# EAGLE board mcat-4cu-b-v2c (EAGLE 6.5.0)
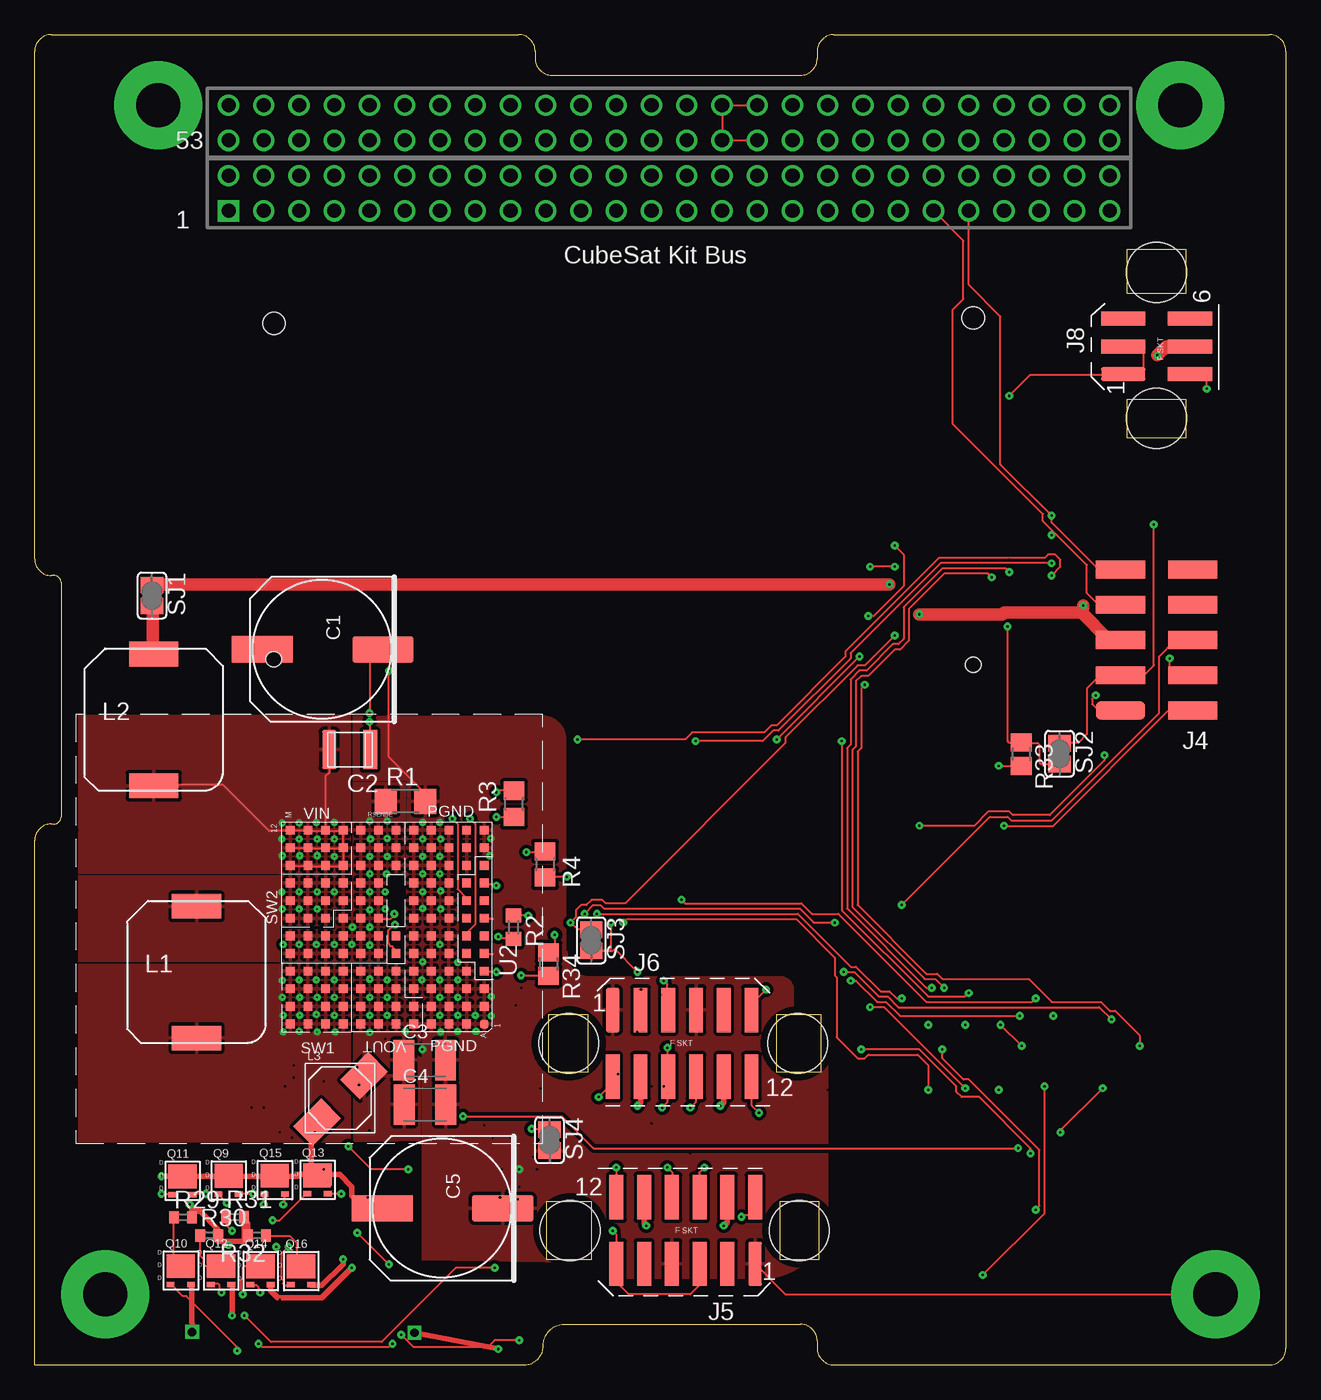
[diagram p5: board, top side]
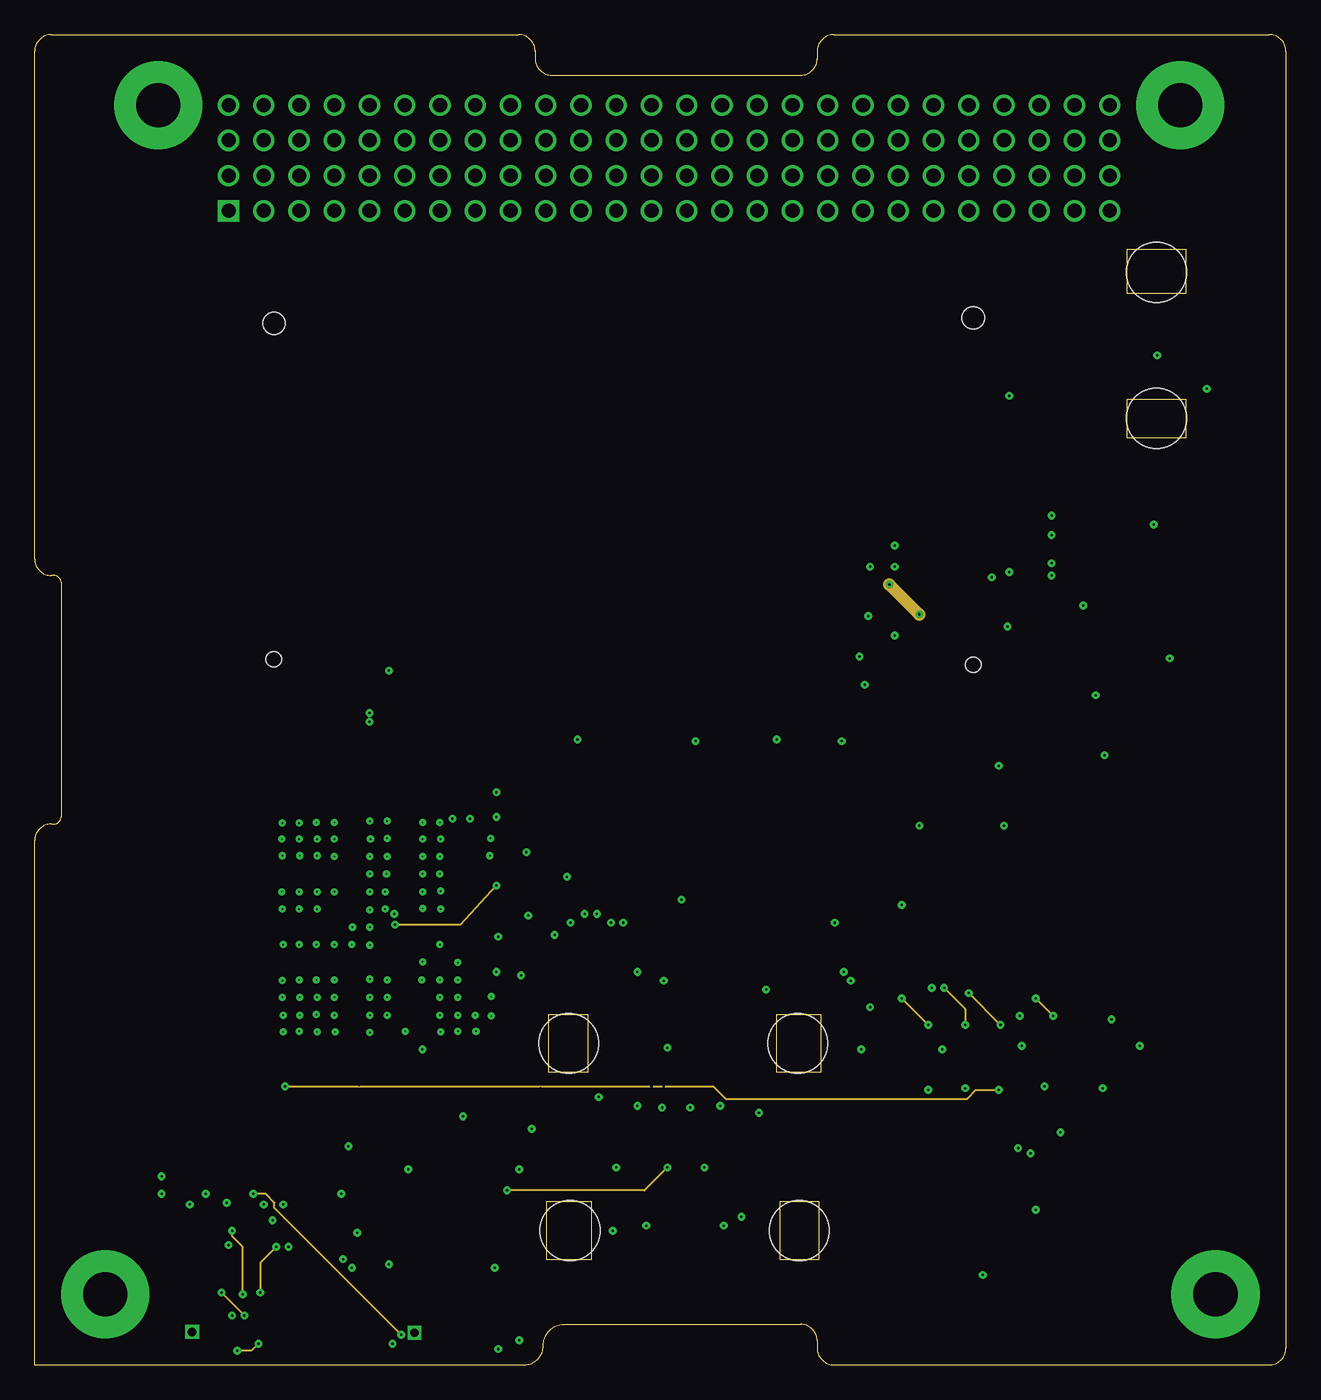
[diagram p6: board, inner layer Route2]
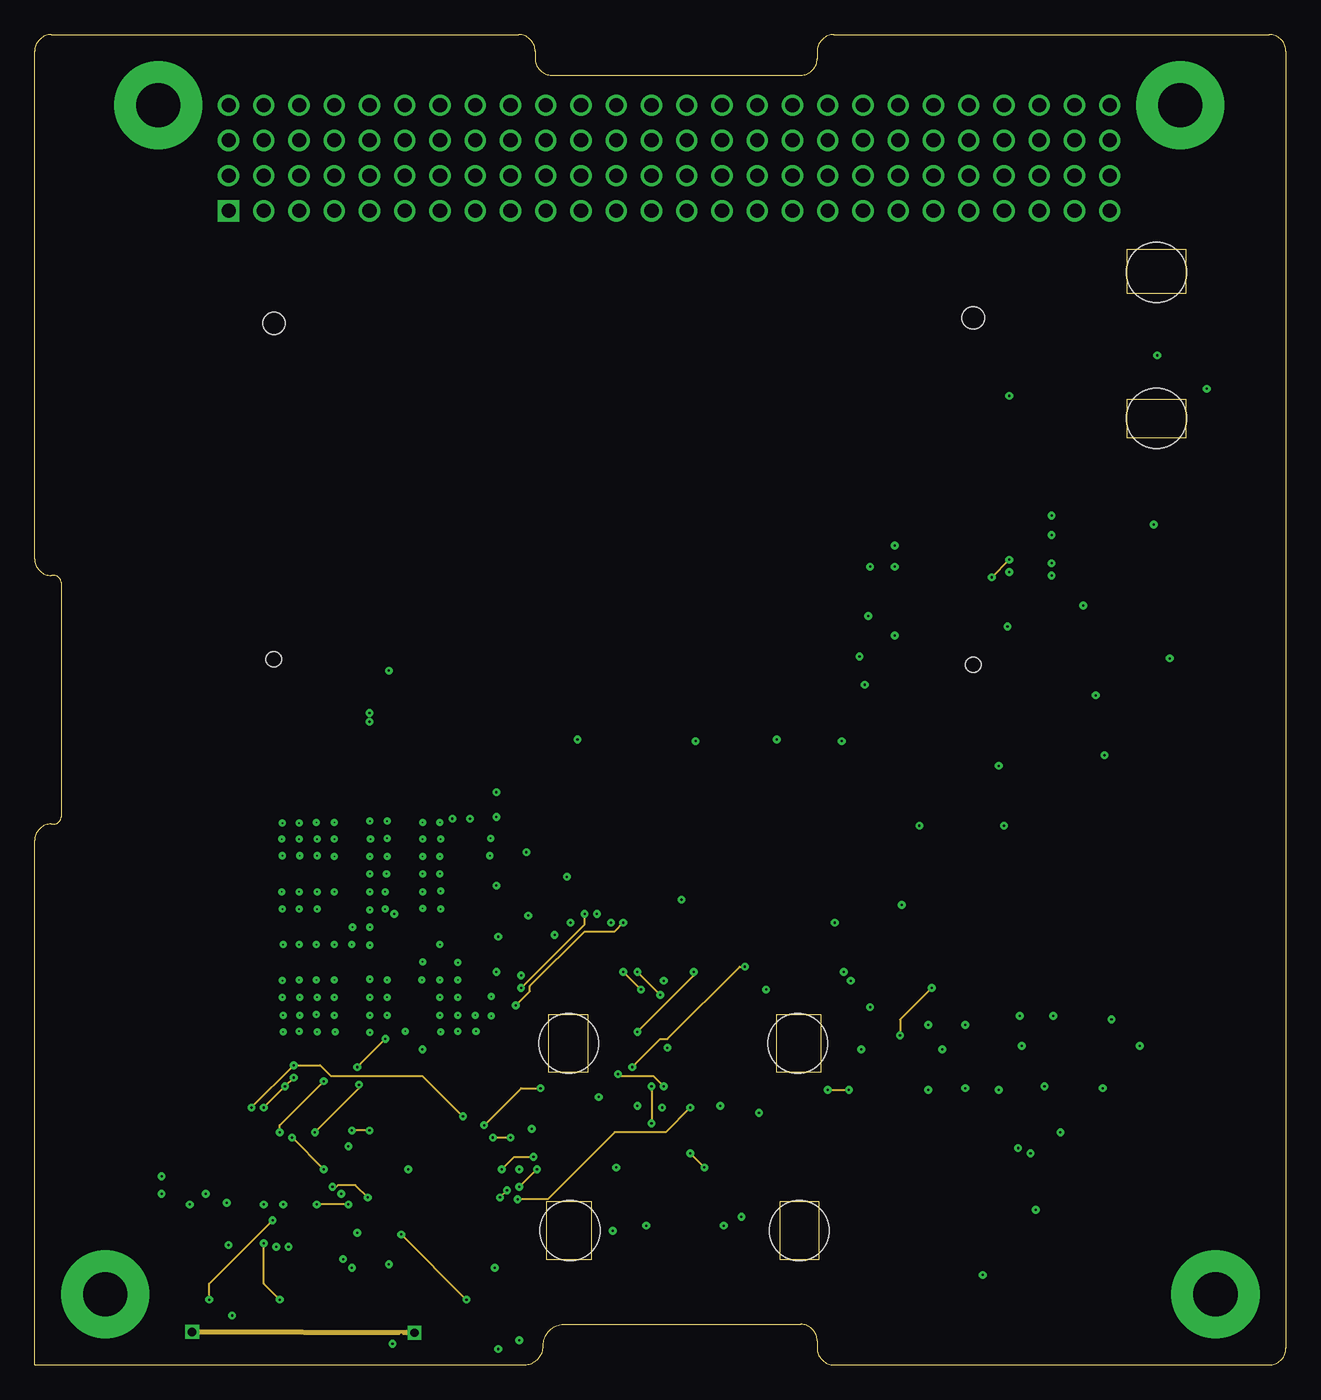
[diagram p7: board, inner layer Route15]
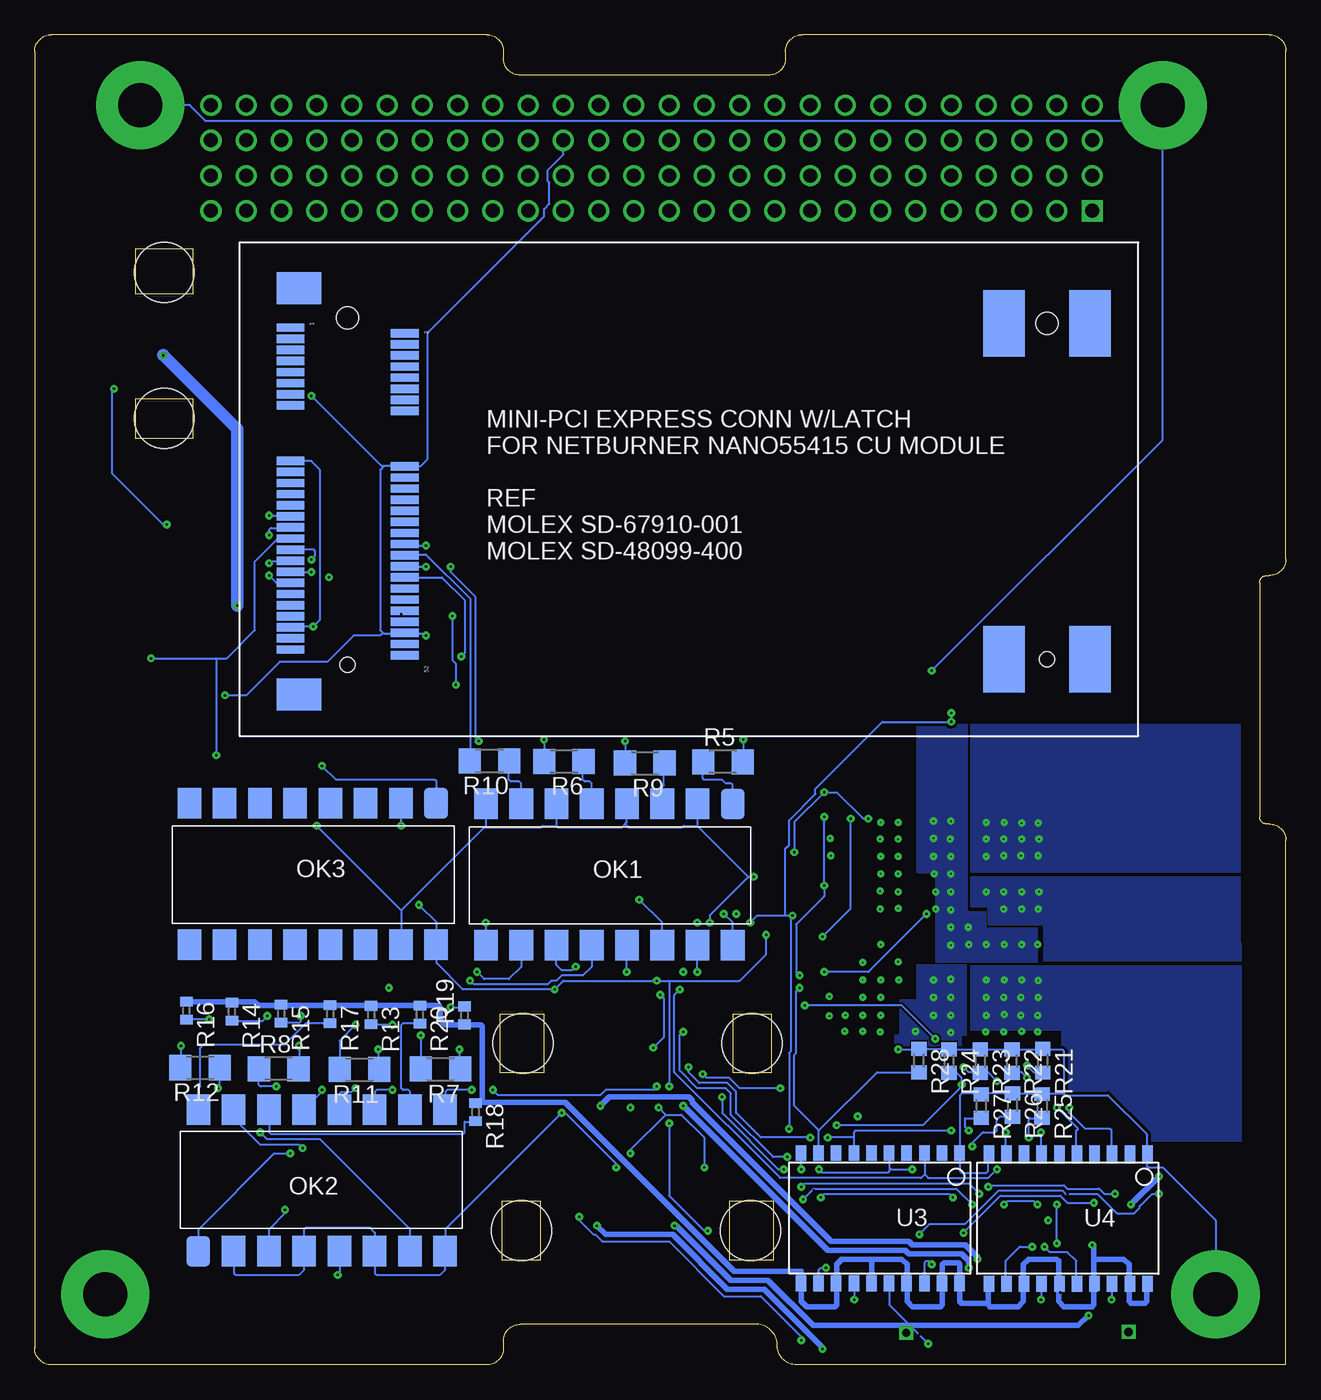
[diagram p8: board, bottom side, seen from below]

Size 90.17 x 95.89 mm. Coordinates in mm from the lower left corner, seen from the top.
Outline: 0,0 34.87,0 35.28,0 arc90 36.65,1.37 arc-90 38.12,2.92 55.19,2.92 arc-90 56.39,1.73 56.39,1.19 arc90 57.58,0 88.98,0 arc90 90.17,1.19 90.17,94.69 arc90 88.98,95.89 57.58,95.89 arc90 56.39,94.69 56.39,94.16 arc-90 55.19,92.96 37.26,92.96 arc-90 36.07,94.16 36.07,94.69 arc90 34.87,95.89 1.19,95.89 arc90 0,94.69 0,58.09 arc90 1.19,56.9 1.4,56.9 arc-90 1.91,56.39 1.91,39.5 arc-90 1.4,38.99 1.19,38.99 arc90 0,37.8 0,0
Copper layers [2:(1+(2*15)+16):15]: Top 0.0694mm / dielectric 8mil / Route2 0.0347mm / dielectric 3.5mil / Route15 0.0347mm / dielectric 8mil / Bottom 0.0694mm
Design rules "SSC-EAGLE-6Lyr_v1.0.0.3 *": minimum track width 6mil, minimum drill 6mil, track to track 6mil, track to pad 6mil, pad to pad 6mil, via to via 6mil, smd to smd 6mil, copper to edge 20mil, drill to drill 16mil, minimum pad ring 8mil, minimum via ring 8mil, stop-mask expansion 3mil, vias tented up to drill 0mil, thermal gap 10mil
Net classes: 0 default: clearance 0.205 mm; 1 vout1a2ozcu: width 0.406 mm; 2 vin2a2ozcu: width 0.889 mm
tRestrict: 30 lines

## Footprints (pad centres in the part's own frame; a part is rotated, then mirrored left to right if it is on the bottom)
OS-CON-SVPF-F12 = smd 1.9 x 4.4: A1 0,-4.3; K1 0,4.4
MLCC-X7R-1210 = smd 1 x 2.8: 1 1.6,0.05; 2 -1.35,0.05
C1210K = smd 1.5 x 2.9: 1 -1.5,0; 2 1.5,0
CSK_MOUNTING_HOLE = drill 3.175 pad 6.35: P$1 0,0
CSK-BUS-PKG = drill 1.016 pad 1.524 square: 1 -29.21,-3.81 | drill 1.016 pad 1.524: 2 -29.21,-1.27; 3 -26.67,-3.81; 4 -26.67,-1.27; 5 -24.13,-3.81; 6 -24.13,-1.27; 7 -21.59,-3.81; 8 -21.59,-1.27; 9 -19.05,-3.81; 10 -19.05,-1.27; 11 -16.51,-3.81; 12 -16.51,-1.27; 13 -13.97,-3.81; 14 -13.97,-1.27; 15 -11.43,-3.81; 16 -11.43,-1.27; 17 -8.89,-3.81; 18 -8.89,-1.27; 19 -6.35,-3.81; 20 -6.35,-1.27; 21 -3.81,-3.81; 22 -3.81,-1.27; 23 -1.27,-3.81; 24 -1.27,-1.27; 25 1.27,-3.81; 26 1.27,-1.27; 27 3.81,-3.81; 28 3.81,-1.27; 29 6.35,-3.81; 30 6.35,-1.27; 31 8.89,-3.81; 32 8.89,-1.27; 33 11.43,-3.81; 34 11.43,-1.27; 35 13.97,-3.81; 36 13.97,-1.27; 37 16.51,-3.81; 38 16.51,-1.27; 39 19.05,-3.81; 40 19.05,-1.27; 41 21.59,-3.81; 42 21.59,-1.27; 43 24.13,-3.81; 44 24.13,-1.27; 45 26.67,-3.81; 46 26.67,-1.27; 47 29.21,-3.81; 48 29.21,-1.27; 49 31.75,-3.81; 50 31.75,-1.27; 51 34.29,-3.81; 52 34.29,-1.27; 53 -29.21,1.27; 54 -29.21,3.81; 55 -26.67,1.27; 56 -26.67,3.81; 57 -24.13,1.27; 58 -24.13,3.81; 59 -21.59,1.27; 60 -21.59,3.81; 61 -19.05,1.27; 62 -19.05,3.81; 63 -16.51,1.27; 64 -16.51,3.81; 65 -13.97,1.27; 66 -13.97,3.81; 67 -11.43,1.27; 68 -11.43,3.81; 69 -8.89,1.27; 70 -8.89,3.81; 71 -6.35,1.27; 72 -6.35,3.81; 73 -3.81,1.27; 74 -3.81,3.81; 75 -1.27,1.27; 76 -1.27,3.81; 77 1.27,1.27; 78 1.27,3.81; 79 3.81,1.27; 80 3.81,3.81; 81 6.35,1.27; 82 6.35,3.81; 83 8.89,1.27; 84 8.89,3.81; 85 11.43,1.27; 86 11.43,3.81; 87 13.97,1.27; 88 13.97,3.81; 89 16.51,1.27; 90 16.51,3.81; 91 19.05,1.27; 92 19.05,3.81; 93 21.59,1.27; 94 21.59,3.81; 95 24.13,1.27; 96 24.13,3.81; 97 26.67,1.27; 98 26.67,3.81; 99 29.21,1.27; 100 29.21,3.81; 101 31.75,1.27; 102 31.75,3.81; 103 34.29,1.27; 104 34.29,3.81
AMPMODU-SMT-PIN-HEADER-5X2 = smd 1.27 x 3.556: 1 -4.826,2.54; 2 -2.286,2.54; 3 0.254,2.54; 4 2.794,2.54; 5 5.334,2.54; 6 -4.826,-2.667; 7 -2.286,-2.667; 8 0.254,-2.667; 9 2.794,-2.667; 10 5.334,-2.667
M80-68112 = smd 1 x 3.2: 1 0,2.4; 2 2,2.4; 3 4,2.4; 4 6,2.4; 5 8,2.4; 6 10,2.4; 7 0,-2.4; 8 2,-2.4; 9 4,-2.4; 10 6,-2.4; 11 8,-2.4; 12 10,-2.4 | hole 4.318: -3.175,0; 13.335,0
M80-68106 = smd 1 x 3.2: 1 -2,2.4; 2 0,2.4; 3 2,2.4; 4 -2,-2.4; 5 0,-2.4; 6 2,-2.4 | hole 4.318: -5.175,0; 5.335,0
MSS1048 = smd 3.56 x 1.78: 1 5,9.85; 2 5,0.35
SERIES-POWER-INDUCTORS = smd 2.85 x 2 rotated 45: 1 1.75,1.6; 2 -1.65,-1.75
PS2501L-4 = smd 2.2 x 1.7: 1 -1.6,19.03; 2 -1.6,16.49; 3 -1.6,13.95; 4 -1.6,11.41; 5 -1.6,8.87; 6 -1.6,6.33; 7 -1.6,3.79; 8 -1.6,1.25; 9 8.6,1.25; 10 8.6,3.79; 11 8.6,6.33; 12 8.6,8.87; 13 8.6,11.41; 14 8.6,13.95; 15 8.6,16.49; 16 8.6,19.03
1206-8-CHIPFET = smd 2.032 x 1.727: D 0,1.321 | smd 0.559 x 0.406: G -0.736,0; S 0.736,0
R1206 = smd 1.6 x 1.803: 1 -1.422,0; 2 1.422,0
R0603 = smd 1 x 1.1: 1 -0.85,0; 2 0.85,0
R0805 = smd 1.3 x 1.5: 1 -0.95,0; 2 0.95,0
R0402 = smd 0.7 x 0.9: 1 -0.65,0; 2 0.65,0
R0805' = smd 1.3 x 1.5: 1 -0.85,0; 2 0.85,0
SJ = smd 1.168 x 1.6: 1 -0.762,0; 2 0.762,0
MOLEX-MINI-PCI-EXPRESS-8MM-52CKT = smd 0.6 x 2: 1 -11.65,-26.8; 2 -11.248,-18.576; 3 -10.85,-26.8; 4 -10.447,-18.576; 5 -10.05,-26.8; 6 -9.648,-18.576; 7 -9.25,-26.8; 8 -8.848,-18.576; 9 -8.45,-26.8; 10 -8.047,-18.576; 11 -7.65,-26.8; 12 -7.247,-18.576; 13 -6.85,-26.8; 14 -6.447,-18.576; 15 -6.05,-26.8; 16 -5.647,-18.576; 17 -2.05,-26.8; 18 -1.647,-18.576; 19 -1.25,-26.8; 20 -0.848,-18.576; 21 -0.45,-26.8; 22 -0.048,-18.576; 23 0.35,-26.8; 24 0.752,-18.576; 25 1.15,-26.8; 26 1.552,-18.576; 27 1.95,-26.8; 28 2.353,-18.576; 29 2.75,-26.8; 30 3.152,-18.576; 31 3.55,-26.8; 32 3.953,-18.576; 33 4.35,-26.8; 34 4.753,-18.576; 35 5.15,-26.8; 36 5.553,-18.576; 37 5.95,-26.8; 38 6.353,-18.576; 39 6.75,-26.8; 40 7.152,-18.576; 41 7.55,-26.8; 42 7.952,-18.576; 43 8.35,-26.8; 44 8.752,-18.576; 45 9.15,-26.8; 46 9.553,-18.576; 47 9.95,-26.8; 48 10.352,-18.576; 49 10.75,-26.8; 50 11.152,-18.576; 51 11.55,-26.8; 52 11.953,-18.576 | smd 2.3 x 3.2: P$1 -14.5,-26.2; P$2 14.8,-26.2 | smd 4.8 x 3: P$3 12.25,24.6; P$4 -11.95,24.6; P$5 -11.95,30.8; P$6 12.25,30.8 | hole 1.6: -12.35,-22.7; -11.95,27.7 | hole 1.1: 12.65,-22.7; 12.25,27.7
LGA-141-LTC-05-08-1840-B = smd 0.63 x 0.63: A1 -7.116,-10.192; A2 -5.846,-10.192; A3 -4.576,-10.192; A4 -3.306,-10.192; A5 -2.036,-10.192; A6 -0.766,-10.192; A7 0.504,-10.192; A8 1.774,-10.192; A9 3.044,-10.192; A10 4.314,-10.192; A11 5.584,-10.192; A12 6.854,-10.192; B1 -7.116,-8.922; B2 -5.846,-8.922; B3 -4.576,-8.922; B4 -3.306,-8.922; B5 -2.036,-8.922; B6 -0.766,-8.922; B7 0.504,-8.922; B8 1.774,-8.922; B9 3.044,-8.922; B10 4.314,-8.922; B11 5.584,-8.922; B12 6.854,-8.922; C1 -7.116,-7.652; C2 -5.846,-7.652; C3 -4.576,-7.652; C4 -3.306,-7.652; C5 -2.036,-7.652; C6 -0.766,-7.652; C7 0.504,-7.652; C8 1.774,-7.652; C9 3.044,-7.652; C10 4.314,-7.652; C11 5.584,-7.652; C12 6.854,-7.652; D1 -7.116,-6.382; D2 -5.846,-6.382; D3 -4.576,-6.382; D4 -3.306,-6.382; D5 -2.036,-6.382; D6 -0.766,-6.382; D7 0.504,-6.382; D8 1.774,-6.382; D9 3.044,-6.382; D10 4.314,-6.382; D11 5.584,-6.382; D12 6.854,-6.382; E1 -7.116,-5.112; E2 -5.846,-5.112; E3 -4.576,-5.112; E4 -3.306,-5.112; E5 -2.036,-5.112; E6 -0.766,-5.112; E7 0.504,-5.112; E8 1.774,-5.112; E9 3.044,-5.112; E10 4.314,-5.112; E11 5.584,-5.112; E12 6.854,-5.112; F1 -7.116,-3.842; F2 -5.846,-3.842; F3 -4.576,-3.842; F4 -3.306,-3.842; F5 -2.036,-3.842; F6 -0.766,-3.842; F10 4.314,-3.842; F11 5.584,-3.842; F12 6.854,-3.842; G1 -7.116,-2.572; G2 -5.846,-2.572; G3 -4.576,-2.572; G4 -3.306,-2.572; G5 -2.036,-2.572; G6 -0.766,-2.572; G7 0.504,-2.572; G8 1.774,-2.572; G9 3.044,-2.572; G10 4.314,-2.572; G11 5.584,-2.572; G12 6.854,-2.572; H2 -5.846,-1.302; H3 -4.576,-1.302; H4 -3.306,-1.302; H5 -2.036,-1.302; H6 -0.766,-1.302; H7 0.504,-1.302; H8 1.774,-1.302; H9 3.044,-1.302; H10 4.314,-1.302; H11 5.584,-1.302; H12 6.854,-1.302; J5 -2.036,-0.032; J6 -0.766,-0.032; J7 0.504,-0.032; J8 1.774,-0.032; J9 3.044,-0.032; J10 4.314,-0.032; J11 5.584,-0.032; J12 6.854,-0.032; K5 -2.036,1.238; K6 -0.766,1.238; K7 0.504,1.238; K8 1.774,1.238; K9 3.044,1.238; K10 4.314,1.238; K11 5.584,1.238; K12 6.854,1.238; L5 -2.036,2.508; L6 -0.766,2.508; L7 0.504,2.508; L8 1.774,2.508; L9 3.044,2.508; L10 4.314,2.508; L11 5.584,2.508; L12 6.854,2.508; M5 -2.036,3.778; M6 -0.766,3.778; M7 0.504,3.778; M8 1.774,3.778; M9 3.044,3.778; M10 4.314,3.778; M11 5.584,3.778; M12 6.854,3.778; SW1@J1 -7.116,-0.032; SW1@J2 -5.846,-0.032; SW1@J3 -4.576,-0.032; SW1@J4 -3.306,-0.032; SW1@K1 -7.116,1.238; SW1@K2 -5.846,1.238; SW1@K3 -4.576,1.238; SW1@K4 -3.306,1.238; SW1@L1 -7.116,2.508; SW1@L2 -5.846,2.508; SW1@L3 -4.576,2.508; SW1@L4 -3.306,2.508; SW1@M1 -7.116,3.778; SW1@M2 -5.846,3.778; SW1@M3 -4.576,3.778; SW1@M4 -3.306,3.778; VOUT -7.116,-1.302
20-LEAD-PLASTIC-SO = smd 0.762 x 1.143: 1 0,0; 2 1.27,0; 3 2.54,0; 4 3.81,0; 5 5.08,0; 6 6.35,0; 7 7.62,0; 8 8.89,0; 9 10.16,0; 10 11.43,0; 11 11.43,9.398; 12 10.16,9.398; 13 8.89,9.398; 14 7.62,9.398; 15 6.35,9.398; 16 5.08,9.398; 17 3.81,9.398; 18 2.54,9.398; 19 1.27,9.398; 20 0,9.398

## Placement (x,y rotation side)
C1  68uF  [OS-CON-SVPF-F12]  20.7,51.57 270 top
C2  4.7uF  [MLCC-X7R-1210]  22.83,44.4 180 top
C3  10uF  [C1210K]  28.1,21.97 0 top
C4  10uF  [C1210K]  28.13,18.76 0 top
C5  68uF  [OS-CON-SVPF-F12]  29.34,11.28 270 top
H1  MOUNT-PAD-ROUNDCSK_MTG_HOLE_A5  [CSK_MOUNTING_HOLE]  8.89,90.81 0 top
H2  MOUNT-PAD-ROUNDCSK_MTG_HOLE_A5  [CSK_MOUNTING_HOLE]  82.55,90.81 0 top
H3  MOUNT-PAD-ROUNDCSK_MTG_HOLE_A5  [CSK_MOUNTING_HOLE]  85.09,5.08 0 top
HBL  MOUNT-PAD-ROUNDCSK_MTG_HOLE_A5  [CSK_MOUNTING_HOLE]  5.08,5.08 0 top
J2  [CSK-BUS-PKG]  43.18,87 0 top
J4  AMPMODU 5X2 SMT HDR  [AMPMODU-SMT-PIN-HEADER-5X2]  80.78,51.99 90 top
J5  M80-6811242  [M80-68112]  51.92,9.68 180 top
J6  M80-6811242  [M80-68112]  41.66,23.17 0 top
J8  M80-6810642  [M80-68106]  80.84,73.41 90 top
L1  330 uH  [MSS1048]  6.66,23.2 0 top
L2  33 uH  [MSS1048]  3.58,41.39 0 top
L3  10 uH  [SERIES-POWER-INDUCTORS]  21.99,19.23 0 top
OK1  PS2501L-4  [PS2501L-4]  58.9,38.84 270 bottom
OK2  PS2501L-4  [PS2501L-4]  59.34,9.79 90 bottom
OK3  PS2501L-4  [PS2501L-4]  80.28,38.88 270 bottom
Q9  SI5404BDC  [1206-8-CHIPFET]  13.98,12.3 0 top
Q10  SI5404BDC  [1206-8-CHIPFET]  10.53,5.8 0 top
Q11  SI5404BDC  [1206-8-CHIPFET]  10.65,12.27 0 top
Q12  SI5404BDC  [1206-8-CHIPFET]  13.42,5.8 0 top
Q13  SI5404BDC  [1206-8-CHIPFET]  20.38,12.34 0 top
Q14  SI5404BDC  [1206-8-CHIPFET]  16.27,5.77 0 top
Q15  SI5404BDC  [1206-8-CHIPFET]  17.3,12.32 0 top
Q16  SI5404BDC  [1206-8-CHIPFET]  19.19,5.77 0 top
R1  70 mOhms  [R1206]  26.72,40.62 0 top
R2  4k7 0.1%  [R0603]  34.5,31.54 270 top
R3  3K79  [R0805]  34.54,40.43 90 top
R4  1K  [R0805]  36.78,36.07 270 top
R5  5K42 0.1%  [R1206]  40.58,43.47 0 bottom
R6  5K42 0.1%  [R1206]  52.04,43.51 180 bottom
R7  5K42 0.1%  [R1206]  60.94,21.32 180 bottom
R8  5K42 0.1%  [R1206]  72.59,21.34 0 bottom
R9  5K42 0.1%  [R1206]  46.21,43.37 180 bottom
R10  5K42 0.1%  [R1206]  57.4,43.53 180 bottom
R11  5K42 0.1%  [R1206]  66.77,21.3 180 bottom
R12  5K42 0.1%  [R1206]  78.26,21.42 180 bottom
R13  100K 0.1%  [R0402]  65.92,25.22 270 bottom
R14  100K 0.1%  [R0402]  75.96,25.46 270 bottom
R15  100K 0.1%  [R0402]  72.41,25.31 270 bottom
R16  100K 0.1%  [R0402]  79.24,25.53 270 bottom
R17  100K 0.1%  [R0402]  68.87,25.28 270 bottom
R18  100K 0.1%  [R0402]  58.41,18.22 270 bottom
R19  100K 0.1%  [R0402]  59.2,25.19 90 bottom
R20  100K 0.1%  [R0402]  62.42,25.24 270 bottom
R21  51K 0.1%  [R0603]  17.54,21.92 270 bottom
R22  51K 0.1%  [R0603]  19.75,21.89 270 bottom
R23  51K 0.1%  [R0603]  22.04,21.9 270 bottom
R24  51k 0.1%  [R0603]  24.28,21.89 270 bottom
R25  51K 0.1%  [R0603]  17.57,18.66 270 bottom
R26  51K 0.1%  [R0603]  19.71,18.72 270 bottom
R27  51K 0.1%  [R0603]  21.97,18.65 270 bottom
R28  51k 0.1%  [R0603]  26.45,21.93 270 bottom
R29  0.1R 1% PTC  [R0402]  10.68,10.63 0 top
R30  0.1R 1% PTC  [R0402]  12.58,9.33 0 top
R31  0.1R 1% PTC  [R0402]  14.44,10.66 0 top
R32  0.1R 1% PTC  [R0402]  16.02,9.33 180 top
R33  1K  [R0805']  71.09,44.03 270 top
R34  604R  [R0805']  37.03,28.89 270 top
SJ1  [SJ]  8.45,55.45 270 top
SJ2  [SJ]  73.85,44.05 270 top
SJ3  [SJ]  40.1,30.6 270 top
SJ4  [SJ]  37.1,16.2 270 top
U1  UCAT-4CU-B-CONTROL-UNITNANO55415  [MOLEX-MINI-PCI-EXPRESS-8MM-52CKT]  44.93,63.11 270 bottom
U2  LTM4609MPV#PBF  [LGA-141-LTC-05-08-1840-B]  22.2,31.69 90 top
U3  LT1161ISW  [20-LEAD-PLASTIC-SO]  23.52,15.26 180 bottom
U4  LT1161ISW  [20-LEAD-PLASTIC-SO]  9.98,15.25 180 bottom

## Tracks (layer width: path | path; a pad name or v marks a point on that pad's centre or on a via)
CH1_P18H  (via drill 0.15, 0.6)
  Top 0.406: v11.34,2.38 11.32,3.65 11.3,5.71 Q10.S | v33.4,1.14 v27.37,2.31 | v49.66,10.03 49.91,10.29 49.91,12.06 J5.8
  Route15 0.406: v27.37,2.31 v11.34,2.38
  Bottom 0.406: v33.4,1.14 33.4,1.27 37.59,5.46 40.26,5.46 44.2,9.4 49.02,9.4 v49.66,10.03
CH1_P18L  (via drill 0.15, 0.15 layers 1-2)
  Top 0.152: v15.75,12.32 14.73,12.32 Q9.S | v26.42,2.16 27.3,1.27 32.64,1.27 33.15,1.78 v34.92,1.78 | v50.93,10.67 51.05,10.79 51.82,10.79 51.94,10.92 51.94,12.06 J5.7
  Route2 0.152: v15.75,12.32 16.64,12.32 17.27,11.68 17.27,11.3 v26.42,2.16
  Bottom 0.152: v34.92,1.78 34.92,2.03 37.85,4.95 40.51,4.95 44.45,8.89 49.28,8.89 49.78,9.4 49.91,9.4 50.93,10.41 v50.93,10.67
CH1HG  (via drill 0.15, 0.15 layers 1-2)
  Top 0.152: v14.61,1.02 14.61,1.27 10.92,4.95 10.67,4.95 9.91,5.71 Q10.G | v16.13,1.52 16.38,1.27 25.53,1.27 v25.78,1.52
  Route2 0.152: v14.61,1.02 15.62,1.02 v16.13,1.52
  Bottom 0.152: v25.78,1.52 28.57,4.32 28.57,5.84 U3.16
CH1LG  (via drill 0.15)
  Top 0.152: v13.84,11.68 13.34,12.19 Q9.G | v25.53,7.24 v23.24,9.53
  Bottom 0.152: v13.84,11.68 15.75,11.68 16.26,12.19 20.57,12.19 v23.24,9.53 | v25.53,7.24 25.78,7.49 25.91,7.49 26.04,7.37 26.04,5.97 U3.18
CH1S
  Top 0.152: R29.1 10.03,10.54 10.03,7.11 10.41,7.11 Q10.D
CH2_P18H  (via drill 0.15)
  Top 0.406: v14.22,3.56 14.22,5.71 Q12.S | v44.07,10.03 43.94,10.16 43.94,12.06 J5.11
  Bottom 0.406: v14.22,3.56 14.97,2.86 34.05,2.86 37.34,6.1 40.01,6.1 43.94,10.03 v44.07,10.03
CH2_P18L  (via drill 0.15, 0.15 layers 1-2, 0.15 layers 15-16, 0.15 layers 2-15)
  Top 0.152: v12.32,12.32 11.43,12.32 Q11.S | v45.59,14.22 45.97,13.84 45.97,12.19 J5.10
  Route2 0.152: v34.04,12.57 43.94,12.57 v45.59,14.22
  Route15 0.152: v21.46,12.83 21.72,12.83 21.84,12.95 23.11,12.95 v24,12.06 | v34.04,12.57 v33.53,12.06
  Bottom 0.152: v12.32,12.32 13.08,12.32 13.46,12.7 15.75,12.7 16,12.95 21.34,12.95 v21.46,12.83 | v24,12.06 24.26,12.32 33.27,12.32 v33.53,12.06
CH2HG  (via drill 0.15, 0.15 layers 1-2)
  Top 0.152: v13.46,5.21 13.34,5.33 13.34,5.71 13.21,5.84 12.7,5.84 Q12.G | v15.11,3.56 17.02,1.65 25.02,1.65 30.35,6.99 v33.15,6.99
  Route2 0.152: v15.11,3.56 v13.46,5.21
  Bottom 0.152: v33.15,6.99 33.53,6.99 33.66,6.86 33.66,5.97 U3.12
CH2LG  (via drill 0.15, 0.15 layers 15-16)
  Top 0.152: v9.14,12.32 9.91,12.32 Q11.G
  Route15 0.152: v31.11,4.7 v26.42,9.4
  Bottom 0.152: v9.14,12.32 9.65,12.32 10.54,11.43 10.54,11.3 10.92,10.92 12.19,10.92 13.59,12.32 15.88,12.32 16.13,12.57 20.7,12.57 23.11,10.16 25.65,10.16 v26.42,9.4 | v31.11,4.7 31.11,5.84 U3.14
CH2S
  Top 0.152: R30.1 11.94,9.27 11.94,7.87 12.19,7.62 12.19,7.24 12.32,7.11 13.34,7.11 Q12.D
CH3_P18H  (via drill 0.15)
  Top 0.406: v22.86,6.99 20.7,4.83 17.53,4.83 17.02,5.33 17.02,5.71 Q14.S | v43.43,18.67 43.69,18.92 43.69,20.7 J6.8
  Bottom 0.406: v22.86,6.99 22.86,7.49 23.37,8 27.18,8 27.43,8.26 33.02,8.26 v43.43,18.67
CH3_P18L  (via drill 0.15, 0.15 layers 15-16)
  Top 0.152: v22.1,12.32 21.21,12.32 Q13.S | v40.64,19.3 41.15,19.81 41.53,19.81 41.66,19.94 41.66,20.7 J6.7
  Route15 0.152: v36.2,14.1 v34.92,12.83
  Bottom 0.152: v22.1,12.32 22.86,13.08 34.67,13.08 v34.92,12.83 | v36.2,14.1 36.58,14.1 40.64,18.16 v40.64,19.3
CH3HG  (via drill 0.15, 0.15 layers 1-2)
  Top 0.152: v16.26,5.21 16.13,5.33 16.13,5.59 16,5.71 15.62,5.71 Q14.G
  Route2 0.152: v16.26,5.21 16.26,7.37 v17.4,8.51
  Bottom 0.152: v17.4,8.51 17.02,8.13 15.75,8.13 15.11,7.49 15.11,5.97 U4.16
CH3LG  (via drill 0.15, 0.15 layers 15-16)
  Top 0.152: v17.14,10.41 17.65,10.41 19.56,12.32 Q13.G
  Route15 0.152: v17.14,10.41 12.57,5.84 v12.57,4.7
  Bottom 0.152: v12.57,4.7 12.57,5.84 U4.18
CH3S  (via drill 0.15 layers 1-2)
  Top 0.152: v14.22,9.65 13.84,10.03 13.84,10.54 R31.1 | v14.99,5.08 14.99,5.33 14.86,5.46 14.86,6.1 14.99,6.22 14.99,6.99 15.11,7.11 16.26,7.11 Q14.D
  Route2 0.152: v14.22,9.65 14.22,9.27 14.99,8.51 v14.99,5.08
CH4_P18H  (via drill 0.15)
  Top 0.406: v22.23,7.62 22.23,7.24 20.7,5.71 19.94,5.71 Q16.S | v49.4,18.67 49.66,18.92 49.66,20.7 J6.11
  Bottom 0.406: v22.23,7.62 22.23,7.75 23.11,8.64 26.92,8.64 27.18,8.89 32.77,8.89 42.8,18.92 42.8,19.05 43.05,19.3 48.77,19.3 v49.4,18.67
CH4_P18L  (via drill 0.15, 0.15 layers 15-16)
  Top 0.152: v17.91,11.56 18.03,11.68 Q15.S | v47.24,18.54 47.62,18.92 47.62,20.7 J6.10
  Route15 0.152: v22.61,11.56 v20.32,11.56 | v34.8,11.94 36.96,11.94 41.78,16.76 45.47,16.76 v47.24,18.54
  Bottom 0.152: v17.91,11.56 18.16,11.81 20.07,11.81 v20.32,11.56 | v22.61,11.56 23.75,12.7 34.04,12.7 v34.8,11.94
CH4HG  (via drill 0.15)
  Top 0.152: v18.29,8.51 17.78,8 17.78,6.22 17.91,6.1 17.91,5.84 18.03,5.71 18.41,5.71 Q16.G
  Bottom 0.152: v18.29,8.51 19.18,8.51 20.19,7.49 20.19,5.97 U4.12
CH4LG  (via drill 0.15, 0.15 layers 15-16)
  Top 0.152: v16.51,11.56 16.51,12.32 Q15.G
  Route15 0.152: v16.51,8.76 16.51,5.84 v17.65,4.7
  Bottom 0.152: v16.51,8.76 v16.51,11.56 | v17.65,4.7 17.65,5.84 U4.14
CH4S
  Top 0.152: R32.1 16.76,9.27 18.41,9.27 18.92,8.76 18.92,7.11 19.18,7.11 Q16.D
GND  (via drill 0.15)
  Top 0.152: v24.13,46.35 24.13,44.45 C2.2 | v24.13,46.99 24.13,51.44 24.26,51.56 25.02,51.56 C1.K1 | v35.56,32.38 34.54,32.38 R2.1 | SJ3.1 40.01,31.37 39.12,31.37 v38.61,31.88 38.99,32.26 38.99,32.77 39.37,33.15 39.75,33.15 40.13,33.53 40.89,33.53 41.15,33.27 42.55,33.27 54.1,44.83 54.1,45.21 59.31,50.42 59.82,50.42 v61.98,52.58 | v35.81,17.02 37.08,17.02 SJ4.1 | J2.83 J2.81 J2.82 J2.84 | J8.2 78.49,73.41 79.76,73.41 79.88,73.28 79.88,71.5 79.76,71.37 78.49,71.37 J8.1 78.36,71.37 71.75,71.37 v70.23,69.85 | v76.45,48.26 76.2,48.01 76.2,47.62 76.71,47.12 78.23,47.12 J4.1
  Bottom 0.152: v24.13,46.99 v24.13,46.35 29.08,46.35 33.91,41.53 33.91,41.15 35.81,39.24 35.81,37.47 36.07,37.21 36.07,32.38 | 36.07,32.38 38.1,32.38 v38.61,31.88 | 36.07,32.38 35.69,32.38 | v35.81,17.02 35.81,22.48 35.69,22.61 35.69,32.38 | 35.69,32.38 v35.56,32.38 | 65.02,52.7 63.63,52.7 U1.48 63.5,52.7 62.1,52.7 v61.98,52.58 | 65.02,52.7 65.28,52.96 65.28,64.52 65.02,64.77 | 65.02,64.77 63.63,64.77 U1.18 62.36,64.77 61.85,65.28 61.85,74.42 53.47,82.8 53.47,83.31 53.09,83.69 53.09,85.22 53.21,85.34 53.21,86.11 52.07,87.25 J2.83 | v76.45,48.26 74.93,48.26 72.52,50.67 69.09,50.67 67.18,52.58 65.28,52.58 65.15,52.7 65.02,52.7 | v70.23,69.85 65.15,64.77 65.02,64.77
I2C(CLK)  (via drill 0.15)
  Top 0.152: J4.5 78.23,57.28 76.71,57.28 73.28,60.71 v73.28,61.21 69.6,64.9 69.6,75.56 67.31,77.85 J2.43
  Bottom 0.152: v73.28,61.21 71.75,61.21 U1.27
I2C(DATA)  (via drill 0.15)
  Top 0.152: 73.66,59.82 v73.28,59.82 | 73.66,59.82 75.82,57.66 75.82,55.63 76.71,54.74 78.23,54.74 J4.4 | J2.41 66.93,81.03 66.93,76.83 66.17,76.07 66.17,67.82 72.64,61.34 72.64,60.83 73.66,59.82
  Bottom 0.152: v73.28,59.82 73.28,60.2 73.15,60.33 71.75,60.33 U1.29
INTVCC  (via drill 0.15, 0.15 layers 1-2)
  Top 0.152: v25.97,31.73 25.91,31.73 25.45,31.27 25.45,30.53 25.6,30.18 25.73,30.18 26.04,29.72 U2.F5 | v33.27,34.54 33.15,34.67 32.51,34.67 U2.A9 | v35.05,28.07 36.96,28.07 R34.2 | v33.27,39.5 34.54,39.5 R3.1
  Route2 0.152: v25.97,31.73 30.66,31.73 v33.27,34.54
  Bottom 0.152: v35.05,28.07 35.31,28.32 35.31,31.75 33.27,33.78 v33.27,34.54 v33.27,39.5
N$2
  cutout Top (isolate 0.254): 32.84,27.78 31.78,27.78 31.78,29.03 30.59,29.03 30.59,35.34 31.84,35.34 31.84,36.59 33.03,36.59 33.03,27.78 32.21,27.78
N$4  (via drill 0.15, 0.15 layers 1-2)
  Top 0.152: v62.48,26.42 62.1,26.42 61.59,26.92 60.96,26.92 59.18,28.7 58.8,28.7 54.99,32.51 v40.51,32.51
  Route2 0.152: v62.48,26.42 v64.39,24.51
  Bottom 0.152: v64.39,24.51 65.91,24.51 R13.2 | v40.51,32.51 39.88,31.88 39.88,30.35 OK1.16
N$5  (via drill 0.15, 0.15 layers 1-2)
  Top 0.152: v72.14,26.42 71.88,26.16 64.26,26.16 57.91,32.51 56.01,32.51 55.24,33.27 46.86,33.27 v46.61,33.53
  Route2 0.152: v72.14,26.42 v73.41,25.15
  Bottom 0.152: v73.41,25.15 73.79,24.77 75.95,24.77 R14.2 | v46.61,33.53 44.96,31.88 44.96,30.35 OK1.14
N$7  (via drill 0.15)
  Top 0.152: v70.99,25.15 62.36,25.15 61.34,26.16 60.71,26.16 59.18,27.69 v58.8,27.69
  Bottom 0.152: v70.99,25.15 70.99,24.77 71.12,24.64 72.39,24.64 R15.2 | v58.8,27.69 58.55,27.43 53.21,27.43 52.96,27.69 52.58,27.69 52.2,28.07 50.67,28.07 50.04,28.7 50.04,30.23 OK1.12
N$8  (via drill 0.15)
  Top 0.152: v31.37,39.37 31.75,38.99 31.75,31.75 31.24,31.24 31.24,30.99 U2.B6 | v33.4,30.86 33.53,30.73 34.42,30.73 R2.2
  Bottom 0.152: v31.37,39.37 31.37,32.89 v33.4,30.86
N$9  (via drill 0.15)
  Top 0.152: v77.6,24.89 76.71,25.78 62.23,25.78 61.47,26.54 60.83,26.54 59.05,28.32 v58.29,28.32
  Bottom 0.152: v77.6,24.89 79.12,24.89 R16.2 | v58.29,28.32 57.78,27.81 56.01,27.81 55.12,28.7 55.12,30.23 OK1.10
N$10
  Bottom 0.152: R17.2 68.96,24.64 70.61,24.64 72.14,23.11 77.98,23.11 78.23,22.86 78.23,20.07 78.36,19.94 78.36,18.41 OK2.16
N$11
  Bottom 0.152: R18.2 58.42,17.53 59.18,17.53 59.18,16.76 59.31,16.64 73.15,16.64 73.28,16.76 73.28,18.29 OK2.14
N$12  (via drill 0.15)
  Top 0.152: v60.2,25.78 61.21,25.78 v67.06,19.94
  Bottom 0.152: v60.2,25.78 59.31,25.78 R19.2 | v67.06,19.94 67.31,19.68 68.07,19.68 68.2,19.56 68.2,18.41 OK2.12
N$13
  Bottom 0.152: R20.2 62.48,24.64 63.63,24.64 63.75,24.51 63.75,19.94 63.63,19.81 63.25,19.81 63.12,19.68 63.12,18.41 OK2.10
N$16  (via drill 0.15)
  Top 0.152: v69.47,43.18 70.99,43.18 R33.2
  Bottom 0.152: v69.47,43.18 68.45,42.16 61.34,42.16 61.21,42.04 61.21,40.51 OK3.1
OK1E1  (via drill 0.15 layers 15-16)
  Route15 0.152: v20.83,14.1 v18.54,16.38 | v43.69,27.05 v42.42,28.32
  Bottom 0.152: v18.54,16.38 18.54,17.65 18.41,17.78 17.65,17.78 R25.2 | v20.83,14.1 21.46,13.46 25.78,13.46 26.04,13.72 | 26.04,13.72 26.04,15.24 U3.3 | v42.42,28.32 42.42,30.23 OK1.15 | v43.69,27.05 44.07,26.67 44.07,21.08 36.45,13.46 26.29,13.46 26.04,13.72
OK1E2  (via drill 0.15, 0.15 layers 15-16)
  Top 0.152: v22.61,15.75 24.26,14.1 v26.92,14.1
  Route15 0.152: v47.5,28.32 47.5,28.07 v43.43,24 | v35.94,14.99 34.54,14.99 v33.66,14.1
  Bottom 0.152: v22.61,15.75 22.61,16 21.84,16.76 20.95,16.76 20.83,16.89 20.83,17.65 20.57,17.91 19.81,17.91 R26.2 | v26.92,14.1 28.45,14.1 28.57,14.22 | 28.57,14.22 28.57,15.24 U3.5 | v47.5,28.32 47.5,30.23 OK1.13 | v43.43,24 43.69,23.75 43.69,21.21 42.42,19.94 40.39,19.94 40.01,19.56 40.01,18.03 36.96,14.99 v35.94,14.99 | v33.66,14.1 33.4,13.84 28.7,13.84 28.57,13.97 28.57,14.22
OK1E3  (via drill 0.15 layers 15-16)
  Route15 0.152: v24.13,16.89 v22.86,16.89 | v51.18,28.7 50.8,28.7 45.59,23.5 45.09,23.5 v43.05,21.46 | v33.02,16.38 v34.29,16.38
  Bottom 0.152: v22.86,16.89 23.11,17.14 23.11,17.78 21.97,17.78 R27.2 | v24.13,16.89 30.99,16.89 31.11,16.76 31.11,16.38 | 31.11,16.38 31.11,15.37 U3.7 | v51.18,28.7 51.44,28.45 52.2,28.45 52.58,28.83 52.58,30.23 OK1.11 | v43.05,21.46 43.05,21.08 42.29,20.32 40.26,20.32 39.62,19.68 39.62,18.16 37.85,16.38 v34.29,16.38 | 31.11,16.38 v33.02,16.38
OK1E4  (via drill 0.15, 0.15 layers 15-16)
  Top 0.152: v57.66,31.88 56.13,31.88 55.12,32.89 41.02,32.89 40.77,33.15 40.26,33.15 v39.62,32.51
  Route15 0.152: v39.62,32.51 39.62,31.75 v35.05,27.18
  Bottom 0.152: 33.66,16.89 29.46,21.08 26.54,21.08 R28.2 | 33.66,16.89 33.66,15.37 U3.9 | v57.66,31.88 57.66,30.35 OK1.9 | v35.05,27.18 35.31,26.92 35.31,22.48 35.43,22.35 35.43,18.67 33.66,16.89
OK2E1  (via drill 0.15, 0.15 layers 15-16)
  Top 0.152: v70.87,15.62 40.26,15.62 37.97,17.91 v30.86,17.91
  Route15 0.152: v15.62,18.54 v18.67,21.59 20.57,21.59 21.34,20.83 27.94,20.83 v30.86,17.91
  Bottom 0.152: v18.67,21.59 18.16,21.08 17.65,21.08 R21.2 | v15.62,18.54 15.62,18.16 14.48,17.02 12.7,17.02 12.57,16.89 12.57,15.37 U4.3 | v70.87,15.62 71.12,15.88 73.91,15.88 75.82,17.78 75.82,18.29 OK2.15
OK2E2  (via drill 0.15, 0.15 layers 15-16, 0.15 layers 2-15)
  Route2 0.152: v69.47,19.81 67.82,19.81 67.18,19.18 49.78,19.18 48.9,20.07 v18.03,20.07
  Route15 0.152: v16.51,18.54 v18.03,20.07 v18.67,20.7
  Bottom 0.152: v18.67,20.7 19.05,21.08 19.68,21.08 R22.2 | v16.51,18.54 14.99,17.02 15.11,16.89 15.11,15.37 U4.5 | v69.47,19.81 69.47,19.68 70.74,18.41 OK2.13
OK2E3  (via drill 0.15, 0.15 layers 15-16)
  Top 0.152: v64.39,19.81 64.39,21.59 63.63,22.35 60.07,22.35 59.82,22.1 59.31,22.1 57.78,23.62 57.78,27.94 57.66,28.07 57.66,29.34 54.86,32.13 42.67,32.13 v42.42,31.88
  Route15 0.152: v20.83,20.45 17.65,17.27 v17.65,16.76 | v42.42,31.88 41.78,31.24 39.62,31.24 35.69,27.3 35.69,26.92 v34.67,25.91 | v23.24,21.46 v25.27,23.5
  Bottom 0.152: v20.83,20.45 21.46,21.08 21.97,21.08 R23.2 22.1,21.08 22.86,21.08 v23.24,21.46 | v17.65,16.76 17.65,15.37 U4.7 | v64.39,19.81 65.53,19.81 65.66,19.68 65.66,18.41 OK2.11 | v34.67,25.91 27.69,25.91 v25.27,23.5
OK2E4  (via drill 0.15 layers 15-16)
  Route15 0.152: v23.37,20.19 23.37,19.94 v20.19,16.76 | v57.15,19.81 v58.67,19.81 | v45.34,20.07 44.58,20.83 42.16,20.83 v42.04,20.95 | v36.45,19.94 35.05,19.94 v32.38,17.27
  Bottom 0.152: v20.19,16.76 20.19,15.37 U4.9 | R24.2 24.26,21.08 23.75,21.08 23.37,20.7 v23.37,20.19 23.37,20.07 26.16,17.27 v32.38,17.27 | v58.67,19.81 60.45,19.81 60.58,19.68 60.58,18.41 OK2.9 | v57.15,19.81 56.77,19.43 49.4,19.43 49.02,19.81 45.59,19.81 v45.34,20.07 | v42.04,20.95 41.78,20.7 40.13,20.7 39.37,19.94 v36.45,19.94
P3  (via drill 0.15)
  Top 0.152: SJ2.2 73.79,43.31 72.52,43.31 72.39,43.43 72.39,44.7 72.26,44.83 71.12,44.83 R33.1 70.99,44.83 70.23,44.83 70.1,44.96 v70.1,53.21
  Bottom 0.152: U1.47 71.63,53.21 v70.1,53.21 69.6,53.72 69.6,64.52 70.23,65.15 71.63,65.15 U1.17
P3_SW  (via drill 0.15)
  Top 0.152: SJ2.1 73.91,44.83 75.18,44.83 75.82,45.47 75.82,48.77 76.71,49.66 78.23,49.66 J4.2 78.36,49.66 79.88,49.66 80.64,50.42 v80.64,60.58 | v84.45,70.36 84.45,71.25 84.33,71.37 83.31,71.37 J8.4
  Bottom 0.152: v84.45,70.36 84.58,70.23 84.58,64.26 80.9,60.58 v80.64,60.58
P18_SW1
  Bottom 0.152: R5.1 42.04,43.43 42.04,42.29 41.91,42.16 40.64,42.16 40.39,41.91 40.01,41.91 39.88,41.78 39.88,40.51 OK1.1
P18_SW2
  Bottom 0.152: R6.1 50.67,43.43 50.67,42.16 50.55,42.04 50.16,42.04 50.04,41.91 50.04,40.51 OK1.5
P18_SW3  (via drill 0.15)
  Top 0.152: v59.56,22.73 63.75,22.73 66.42,20.07 66.42,19.68 66.8,19.3 68.07,19.3 71.75,15.62 v71.75,15.24
  Bottom 0.152: v59.56,22.73 59.56,21.34 R7.1 | v71.75,15.24 72.9,15.24 78.36,9.78 78.36,8.26 OK2.1
P18_SW4  (via drill 0.15)
  Top 0.152: v72.77,20.07 72.77,10.92 v68.33,6.48
  Bottom 0.152: v72.77,20.07 73.91,20.07 74.04,20.19 74.04,21.34 R8.1 | v68.33,6.48 68.2,6.6 68.2,8.13 OK2.5
P18_SW5
  Bottom 0.152: R9.1 44.83,43.31 44.83,41.78 44.96,41.66 44.96,40.51 OK1.3
P18_SW6
  Bottom 0.152: R10.1 56.01,43.43 56.01,42.16 55.88,42.04 55.24,42.04 55.12,41.91 55.12,40.51 OK1.7
P18_SW7  (via drill 0.15)
  Top 0.152: v65.41,22.73 65.41,22.1 66.93,20.57 67.31,20.57 72.39,15.49 72.39,11.43 v72.14,11.18
  Bottom 0.152: v65.41,22.73 65.41,21.34 R11.1 | v72.14,11.18 72.14,10.92 73.28,9.78 73.28,8.26 OK2.3
P18_SW8  (via drill 0.15)
  Top 0.152: v76.96,19.94 73.91,16.89 v73.91,16.76
  Bottom 0.152: v76.96,19.94 76.83,20.07 76.83,21.34 R12.1 | v73.91,16.76 73.41,16.26 69.6,16.26 63.12,9.78 63.12,8.26 OK2.7
PBATT_SW  (via drill 0.15, 0.15 layers 1-2)
  Top 0.889: v61.59,56.26 8.51,56.26 SJ1.1 | v63.75,54.1 69.72,54.1 69.85,54.23 75.44,54.23 | 75.44,54.23 77.34,52.32 78.23,52.32 J4.3 | v80.9,72.77 81.53,73.41 83.19,73.41 J8.5 | v75.56,54.74 75.56,54.61 75.44,54.23
  Route2 0.889: v63.75,54.1 v61.59,56.26
  Bottom 0.889: v80.9,72.77 75.56,67.44 v75.56,54.74
PGND  (via drill 0.1 pad 0.25, 0.15)
  Top 0.152: 33.03,29.59 32.51,29.59 U2.A5 | 33.03,32.13 32.51,32.13 U2.A7 | v25.53,50.04 25.53,43.81 28.07,41.27 28.07,40.64 R1.2 | H3.P$1 54.1,5.08 51.94,7.24 J5.1 | U2.B10 31.11,35.94 31.12,35.94 | U2.B12 31.11,38.48 31.12,38.48
  Bottom 0.152: U4.10 21.46,15.24 21.46,13.97 21.59,13.84 23.37,13.84 23.5,13.97 23.5,15.24 U3.1 23.5,15.37 23.5,19.43 23.37,19.56 21.97,19.56 R27.1 21.84,19.56 19.81,19.56 R26.1 19.68,19.56 17.65,19.56 R25.1 17.53,19.56 16,19.56 | 16,19.56 15.88,19.43 12.83,19.43 10.03,16.64 10.03,15.37 U4.1 10.03,15.24 10.03,14.35 9.91,14.22 8.89,14.22 5.08,10.41 HBL.P$1 | v34.92,14.1 34.92,15.24 U3.10 | v27.94,22.73 26.54,22.73 R28.1 26.42,22.73 24.38,22.73 R24.1 24.26,22.73 22.1,22.73 R23.1 21.97,22.73 19.81,22.73 R22.1 19.68,22.73 17.65,22.73 R21.1 17.53,22.73 16.13,22.73 16,22.61 16,19.56 | 8.89,89.66 8.89,66.67 v25.53,50.04 | H2.P$1 78.99,90.81 77.85,89.66 8.89,89.66 | 8.89,89.66 H1.P$1
  other vias: 29.25,24 30.5,24.05 31.8,24.05 32.9,25.15 31.75,25.2 30.5,25.2 29.2,25.2 29.2,27.75 30.5,27.75 30.5,26.5 29.2,26.5 27.9,27.75 27.95,29.05 30.5,29 29.2,30.3 29.25,32.85 29.25,34.15 27.95,34.1 27.95,32.9 27.95,35.4 29.2,35.4 27.95,36.65 29.2,36.65 27.95,39.1 29.2,39.1 29.25,37.9 27.95,37.9 32.85,37.95 32.8,36.7 32.9,26.55
  pour Top (isolate 0.254): 22.9,46.78 36.5,46.8 36.6,46.8 arc-90 38.3,45.1 38.3,29.9 arc90 38.4,29.8 38.4,29.6 arc90 40,28 53.8,28 arc-90 54.7,27.1 54.7,24.3 arc90 55.4,23.6 arc90 55.5,23.5 55.7,23.5 arc-90 57.2,22 57.2,10.9 arc-90 52.5,6.2 40.95,6.2 arc-61 39.02,7.34 27.9,7.54 27.9,22.15 28.03,26.53 26.78,26.53 26.78,29.03 26.77,29.03 26.78,29.15 26.78,36.97 26.84,42.09 22.9,42.09
RSENSE  (via drill 0.1 pad 0.25, 0.15)
  Top 0.152: v33.27,28.32 32.51,28.32 U2.A4 | v25.91,32.51 25.91,32.38 25.65,32.13 24.89,32.13 U2.G7
  Bottom 0.152: v33.27,28.32 30.1,28.32 v25.91,32.51
  other vias: 17.9,30.3 19.05,30.3 20.3,30.3 21.6,30.3 22.9,31.55 22.9,31.55 22.85,30.3 24.15,30.25 24.15,31.55 24.15,32.8 24.15,32.8 24.15,34.1 24.15,35.4 25.25,34.1 25.25,32.85 25.35,35.4 25.4,36.65 24.15,36.65 25.4,37.95 24.2,37.9 24.15,39.2 25.4,39.2
  pour Top (isolate 0.254): 17.9,29.03 17.9,31.4 21.65,31.4 21.65,32.65 22.9,32.65 22.9,42.03 26.78,42.03 26.65,35.4 25.34,35.4 25.34,29.03
  pour Bottom: 17.9,31.5 21.6,31.5 21.6,31.75 21.6,32.7 22.95,32.7 22.95,33.35 22.95,39.55 22.95,46.2 26.6,46.2 26.6,38.95 26.6,35.75 26.6,35.45 25.25,35.45 25.25,33 25.25,29 17.9,29
SETFREQ  (via drill 0.15)
  Top 0.152: v30.1,39.37 30.48,38.99 30.48,34.29 31.11,33.66 31.11,33.53 U2.B8 | v33.27,41.27 33.4,41.4 34.54,41.4 R3.2 | v35.43,36.96 36.7,36.96 R4.1
  Bottom 0.152: v30.1,39.37 30.48,39.37 32.38,41.27 v33.27,41.27 35.43,39.12 v35.43,36.96
SGND  (via drill 0.15, 0.15 layers 15-16)
  Top 0.152: v41.91,14.22 41.91,12.19 J5.12 | v45.21,18.54 45.59,18.92 45.59,20.7 J6.9 45.59,20.83 v45.59,22.86 | v48.26,14.22 47.88,13.84 47.88,12.19 J5.9 | v52.2,18.16 51.69,18.67 51.69,20.7 J6.12 | v38.35,35.18 36.83,35.18 R4.2 | 41.4,29.84 40.13,29.84 SJ3.2 | 41.4,29.84 41.53,29.97 v41.53,31.88 | v69.85,38.86 73.41,38.86 81.66,47.12 83.44,47.12 J4.6 | v43.43,28.32 41.78,29.97 41.66,29.84 41.4,29.84
  Route15 0.152: v47.24,15.24 v48.26,14.22 | v43.43,28.32 v45.09,26.67
  Bottom 0.152: OK2.2 75.82,8.13 75.82,6.6 75.69,6.48 71.12,6.48 70.74,6.86 70.74,8.13 OK2.4 70.74,8.26 70.74,9.78 70.61,9.91 66.04,9.91 65.66,9.53 65.66,8.26 OK2.6 65.66,8.13 65.66,6.6 65.53,6.48 60.96,6.48 60.58,6.86 60.58,8.13 OK2.8 60.58,8.26 60.58,9.78 v52.2,18.16 51.94,18.16 48.13,14.35 v48.26,14.22 | v41.91,14.22 41.91,16.38 43.56,18.03 44.7,18.03 | v45.21,18.54 44.7,18.03 | v47.24,15.24 47.24,15.49 44.7,18.03 | 38.73,35.18 v38.35,35.18 | 42.42,38.86 38.73,35.18 | 42.42,38.86 42.42,40.39 OK1.2 | v41.53,31.88 41.53,32.38 38.73,35.18 | 47.62,38.99 47.88,38.73 52.45,38.73 52.58,38.86 | 47.62,38.99 47.5,39.12 47.5,40.39 OK1.4 | 52.58,38.86 52.58,40.39 OK1.6 | 63.75,32.77 63.75,30.35 OK3.15 | 57.78,38.73 57.66,38.86 57.66,40.39 OK1.8 | 57.78,38.73 63.75,32.77 | 63.75,32.77 v69.85,38.86 | 52.58,38.86 53.59,38.86 53.72,38.73 57.78,38.73 | 42.42,38.86 43.43,38.86 43.56,38.73 47.37,38.73 47.62,38.99 | v45.59,22.86 44.83,23.62 44.83,26.42 v45.09,26.67
SW1  (via drill 0.1 pad 0.25)
  other vias: 17.85,27.7 19.05,27.75 20.3,27.75 21.6,27.75 21.6,26.5 21.6,25.2 20.3,25.25 19.1,25.2 17.9,25.2 17.85,26.5 19.1,26.5 20.35,26.5 17.9,24 19.05,24.05 19.05,24.05 20.35,24 21.65,24
  pour Top (isolate 0.254): 22.78,28.9 3.15,28.9 3.15,16.03 22.78,16.03
  pour Bottom: 22.7,28.8 20.4,28.8 3.2,28.8 3.2,28.4 3.2,27.1 3.2,20.9 3.2,18.4 3.2,16.1 16.2,16.1 16.2,24.1 22.7,24.1 22.7,24.4
SW2  (via drill 0.1 pad 0.25)
  other vias: 17.8,34.1 19.05,34.1 20.35,34.1 21.6,34.1 20.35,32.85 19.05,32.85 17.85,32.85
  pour Top (isolate 0.254): 17.65,29.03 17.65,31.65 21.4,31.65 21.4,32.9 22.78,32.9 22.78,35.28 3.15,35.28 3.15,29.03
  pour Bottom: 22.7,35.2 22.7,33 21.5,33 21.5,32.8 21.5,31.7 17.6,31.7 17.5,31.7 17.5,29.1 3.2,29.1 3.2,30.4 3.3,30.4 3.3,35.2
SW_P18H1  (via drill 0.15)
  Top 0.152: v47.62,44.96 52.45,44.96 53.21,45.72 53.59,45.72 58.8,50.93 58.8,51.31 65.28,57.78 v73.28,57.78
  Bottom 0.152: v47.62,44.96 47.62,43.43 R9.2 | v73.28,57.78 73.15,57.91 71.75,57.91 U1.35
SW_P18H2
  Bottom 0.152: R10.2 58.8,43.56 58.8,55.24 61.98,58.42 63.5,58.42 U1.34
SW_P18H3  (via drill 0.15, 0.15 layers 1-2, 0.15 layers 15-16)
  Top 0.152: v65.53,27.18 64.9,27.81 64.14,27.81 58.93,33.02 58.93,44.32 59.18,44.58 59.18,49.28 59.56,49.66 60.07,49.66 61.98,51.56 62.36,51.56 62.99,52.2 62.99,54.48 65.53,57.02 68.71,57.02 v68.96,56.77
  Route2 0.152: v67.06,24.51 67.06,25.65 v65.53,27.18
  Route15 0.152: v70.23,58.04 v68.96,56.77
  Bottom 0.152: v67.06,24.51 68.2,23.37 68.2,21.34 R11.2 | v70.23,58.04 69.98,58.29 69.98,58.67 70.1,58.8 71.63,58.8 U1.33
SW_P18H4  (via drill 0.15)
  Top 0.152: v79.63,22.99 79.63,23.75 77.85,25.53 77.47,25.53 76.83,26.16 73.28,26.16 71.63,27.81 65.41,27.81 65.02,28.19 64.26,28.19 59.31,33.15 59.31,44.2 59.56,44.45 59.56,48.77 v59.82,49.02 | v60.07,53.98 60.45,53.98 62.61,56.13 62.61,58.42 v61.98,59.05
  Bottom 0.152: v79.63,22.99 79.63,21.46 R12.2 | v59.82,49.02 59.82,50.55 60.07,50.8 v60.07,53.98 | v61.98,59.05 62.61,59.05 62.74,59.18 63.5,59.18 U1.32
SW_P18L1  (via drill 0.15)
  Top 0.152: v39.12,45.09 46.86,45.09 47.37,45.59 52.58,45.59 53.09,46.1 53.47,46.1 58.42,51.05 58.42,51.44 65.15,58.17 72.77,58.17 73.03,58.42 73.53,58.42 73.91,58.04 73.91,57.53 v73.28,56.9
  Bottom 0.152: v39.12,45.09 39.12,43.56 R5.2 | v73.28,56.9 72.77,56.39 71.75,56.39 U1.39
SW_P18L2  (via drill 0.15)
  Top 0.152: v59.44,51.05 v53.47,45.09
  Bottom 0.152: v53.47,45.09 53.47,43.56 R6.2 | v59.44,51.05 59.18,51.31 59.18,55.12 60.83,56.77 U1.38
SW_P18L3  (via drill 0.15, 0.15 layers 15-16)
  Top 0.152: v64.64,27.18 64.26,27.18 58.55,32.89 58.55,44.45 58.8,44.7 58.8,49.4 59.44,50.04 59.94,50.04 61.85,51.94 62.23,51.94 62.61,52.32 62.61,54.61 65.41,57.4 69.98,57.4 v70.23,57.15
  Route15 0.152: v62.36,23.75 62.36,24.89 v64.64,27.18
  Bottom 0.152: v62.36,23.75 62.36,21.34 R7.2 | v70.23,57.15 71.63,57.15 U1.37
SW_P18L4  (via drill 0.15, 0.15 layers 1-2)
  Top 0.152: v69.6,24.51 v71.12,22.99 | v67.31,26.8 67.06,26.54 64.39,26.54 58.17,32.77 v58.17,44.96 | v61.98,57.53 v60.2,57.53
  Route2 0.152: v67.31,26.8 v69.6,24.51
  Bottom 0.152: v71.12,22.99 71.12,21.46 R8.2 | v58.17,44.96 58.42,45.21 58.42,55.37 60.2,57.15 v60.2,57.53 | v61.98,57.53 63.5,57.53 U1.36
SW_TP1  (via drill 0.15)
  Top 0.152: v81.79,50.93 81.79,49.78 81.92,49.66 83.44,49.66 J4.7 | v63.75,38.86 67.69,38.86 68.71,39.88 70.23,39.88 70.48,39.62 73.15,39.62 77.09,43.56 v77.09,43.94
  Bottom 0.152: U1.31 72.64,59.56 74.3,57.91 74.3,52.96 76.33,50.93 77.09,50.93 | v81.79,50.93 77.09,50.93 | v63.75,38.86 63.75,40.39 OK3.2 | 77.09,50.93 v77.09,43.94
TP1_OUT  (via drill 0.15, 0.15 layers 15-16)
  Top 0.152: J5.3 47.88,7.24 47.88,5.71 47.24,5.08 42.8,5.08 41.91,5.97 41.91,7.24 J5.6 41.91,7.37 41.91,9.4 v41.66,9.65 | v37.47,30.99 37.47,29.72 37.08,29.72 R34.1 | v45.34,27.69 45.59,27.43 45.59,25.65 J6.3 | v52.7,27.05 52.2,26.54 51.82,26.54 51.69,26.42 51.69,25.65 J6.6 | v62.48,33.15 68.83,39.5 70.1,39.5 70.36,39.24 73.28,39.24 81.03,46.99 81.03,51.05 82.17,52.2 83.44,52.2 J4.8
  Route15 0.152: v44.45,20.07 v44.45,17.4
  Bottom 0.152: v37.47,30.99 37.47,29.59 39.37,27.69 44.45,27.69 | 44.45,27.69 v45.34,27.69 52.07,27.69 v52.7,27.05 59.31,27.05 61.21,28.96 61.21,30.23 OK3.16 61.21,30.35 61.21,31.88 v62.48,33.15 | v41.66,9.65 41.91,9.65 44.45,12.19 v44.45,17.4 | 44.45,27.69 v44.45,20.07
VBATT_IN
  Top 0.889: SJ1.2 8.51,54.61 8.51,51.31 L2.1
VIN  (via drill 0.1 pad 0.25)
  Top 0.152: U2.K12 20.95,38.48 19.81,38.48 U2.L12 19.68,38.48 18.54,38.48 U2.M12 18.41,38.48 16.89,38.48 13.59,41.78 8.64,41.78 L2.2 | 22.23,38.48 21.08,38.48 U2.K12 | U2.M10 18.54,35.94 19.68,35.94 U2.L10 19.81,35.94 20.95,35.94 U2.K10 21.08,35.94 22.23,35.94 U2.J10 22.23,36.07 22.23,37.21 | U2.M11 18.54,37.21 19.68,37.21 U2.L11 19.81,37.21 20.95,37.21 U2.K11 21.08,37.21 22.23,37.21 | 22.23,37.21 U2.J11 22.23,37.34 22.23,38.48 | 22.23,38.48 U2.J12 | U2.K12 20.95,38.61 20.95,42.42 21.21,42.67 21.21,44.32 C2.1
  other vias: 19.05,37.9 17.8,37.9 20.35,37.9 21.6,37.9 21.6,39.1 20.3,39.1 19.05,39.05 17.85,39.05 17.85,36.7 19.1,36.7 20.35,36.7 21.6,36.65
  pour Bottom: 22.7,35.5 22.7,37.8 22.7,39.9 22.7,43 22.7,46.2 3.3,46.2 3.3,45.9 3.3,38.7 3.3,35.6 3.3,35.5
  pour Top (isolate 0.254): 22.78,35.4 22.78,46.84 3.15,46.88 3.15,35.4
VOUT  (via drill 0.1 pad 0.25)
  other vias: 24.15,23.95 26.7,24.05 25.4,25.2 24.15,25.2 24.15,26.5 25.4,26.5 24.15,27.8 25.4,27.75
  pour Top (isolate 0.254): 22.96,28.84 22.96,16.03 27.8,16.13 27.8,18.44 27.84,22.78 27.84,26.34 26.59,26.34 26.59,28.84
  pour Bottom: 23,28.85 26.6,28.85 26.6,26.35 26.65,26.35 27.85,26.35 27.85,23.8 28.2,23.8 28.2,16.9 28.2,16.2 23.35,16.2 23.35,23.75 23,23.75 23,24.95
VOUTA  (via drill 0.15)
  Top 0.406: Q13.D 20.32,13.72 19.05,13.72 18.92,13.59 17.4,13.59 Q15.D 17.14,13.59 14.1,13.59 Q9.D 13.97,13.59 10.67,13.59 Q11.D 10.54,13.59 v9.14,13.59 | L3.2 20.32,17.4 19.94,17.02 19.94,13.84 Q13.D | C5.A1 25.02,11.3 23.75,11.3 22.86,12.19 22.86,12.83 21.97,13.72 20.57,13.72 Q13.D | 13.97,8.89 14.99,8.89 15.11,9.02 15.11,10.54 R31.2 15.24,10.29 15.37,10.16 15.37,9.4 R32.2 | 13.97,8.89 13.21,8.89 13.21,9.27 R30.2 13.21,9.53 13.21,9.78 11.94,11.05 11.3,11.05 | 11.3,11.05 11.3,10.67 R29.2 | v13.97,8.64 13.97,8.89 | v11.18,11.56 11.3,11.43 11.3,11.05
  Bottom 0.406: 57.91,18.92 58.29,18.92 R18.1 | 57.91,18.92 57.91,24.38 58.04,24.51 59.18,24.51 R19.1 59.31,24.51 60.58,24.51 60.96,24.89 60.96,25.78 61.09,25.91 62.23,25.91 R20.1 62.48,25.91 65.91,25.91 R13.1 66.04,25.91 68.83,25.91 R17.1 68.96,25.91 72.39,25.91 R15.1 72.52,25.91 74.04,25.91 74.3,26.16 75.82,26.16 R14.1 76.07,26.16 79.12,26.16 R16.1 | 29.84,7.49 29.72,7.62 27.69,7.62 27.3,7.24 27.3,5.97 U3.17 27.3,5.71 27.3,4.57 26.92,4.19 24.89,4.19 24.77,4.32 24.77,5.71 U3.19 24.77,5.97 24.77,7.24 24.64,7.37 23.62,7.37 23.5,7.24 23.5,5.97 U3.20 23.5,5.71 23.5,4.57 23.37,4.45 21.59,4.45 21.46,4.32 | 29.84,7.49 29.84,5.97 U3.15 | 29.84,7.49 29.97,7.62 32,7.62 32.38,7.24 32.38,5.97 U3.13 32.38,5.71 32.38,4.32 32.51,4.19 34.54,4.19 34.92,4.57 34.92,5.84 U3.11 34.92,5.97 34.92,6.73 39.75,6.73 51.94,18.92 57.91,18.92 | 21.46,4.32 21.34,4.19 19.3,4.19 18.92,4.57 18.92,5.84 U4.13 18.92,5.97 18.92,7.24 18.54,7.62 16.51,7.62 16.38,7.49 16.38,5.97 U4.15 16.38,5.84 16.38,4.57 16,4.19 13.97,4.19 13.84,4.32 13.84,5.71 U4.17 13.84,5.97 13.84,7.62 | 21.46,4.32 21.46,5.84 U4.11 | U4.20 10.03,5.84 10.03,4.57 10.16,4.45 11.18,4.45 11.3,4.57 11.3,5.84 U4.19 11.3,5.97 11.3,7.24 11.68,7.62 13.84,7.62 | 13.84,7.62 13.84,8.51 v13.97,8.64 | v11.18,11.56 v9.14,13.59